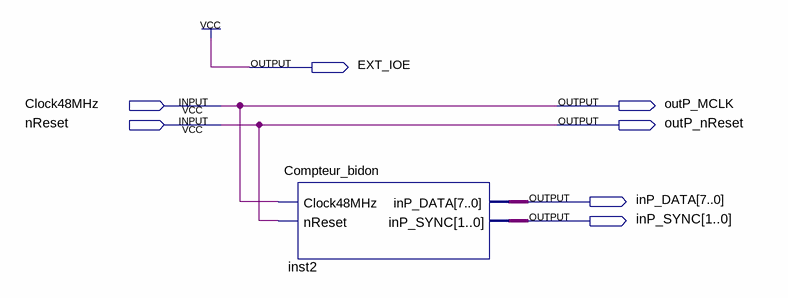
[diagram p0: schematic sheet]
// Quartus schematic ConExt2.bdf as structural Verilog: 1 symbols, 7 pins
module ConExt2 (
  input  Clock48MHz,
  input  nReset,
  output EXT_IOE,
  output outP_MCLK,
  output outP_nReset,
  output [7:0] inP_DATA,
  output [1:0] inP_SYNC
);

  Compteur_bidon inst2 (.Clock48MHz(Clock48MHz), .nReset(nReset), .inP_DATA(inP_DATA), .inP_SYNC(inP_SYNC));

  assign EXT_IOE = 1'b1;
  assign outP_MCLK = Clock48MHz;
  assign outP_nReset = nReset;
endmodule
